# EAGLE design beaglecnc (EAGLE 9.6.2)
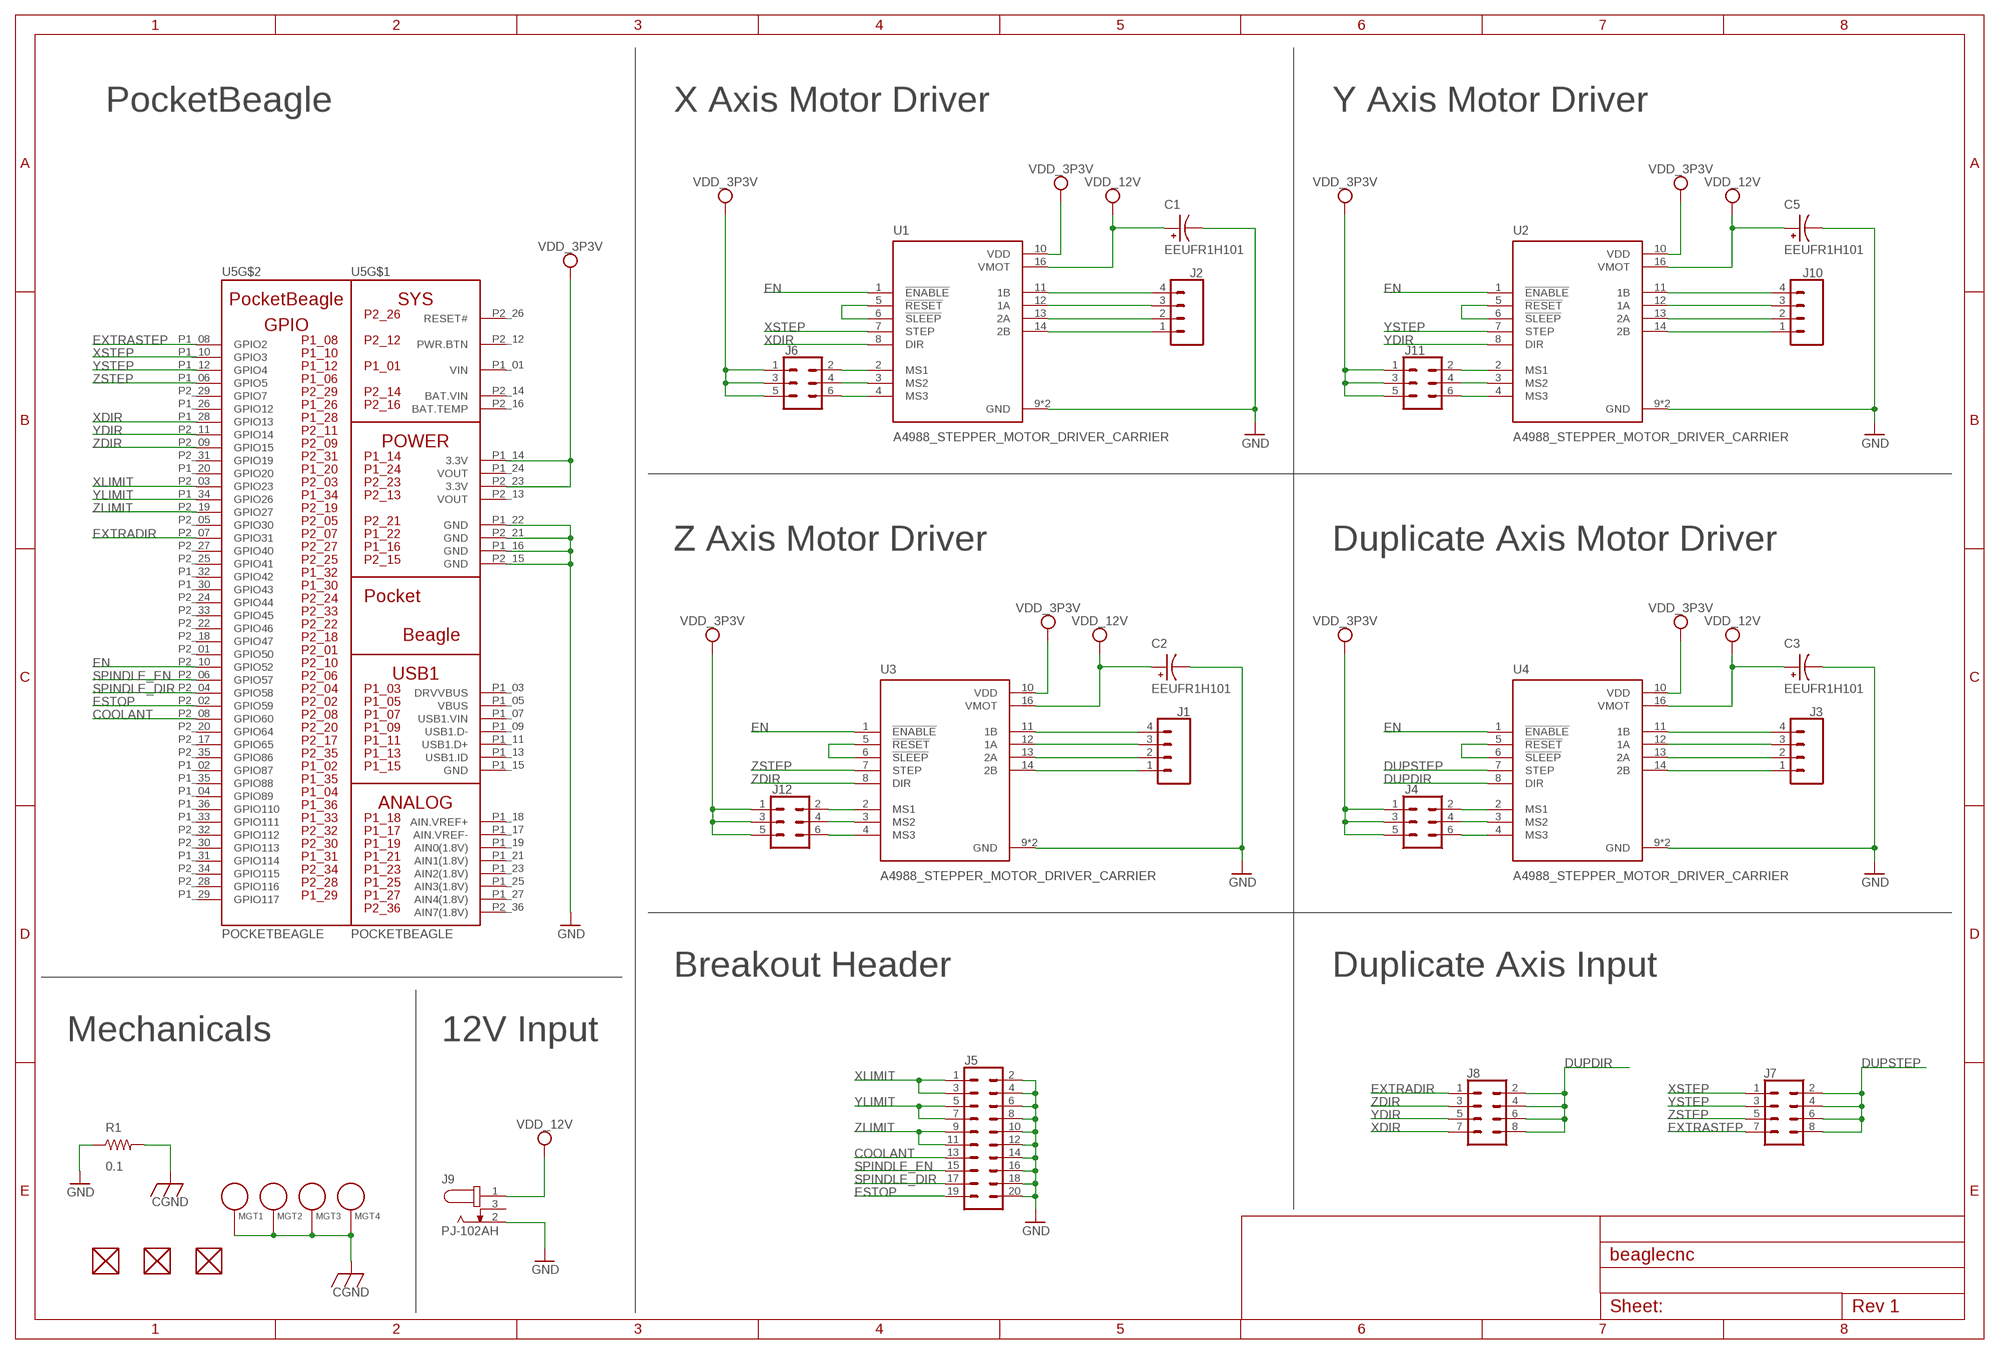
[diagram p0: schematic, sheet 1]

## Parts
C1  EEUFR1H101  [CAPPRD350W60D800H1150]
C2  EEUFR1H101  [CAPPRD350W60D800H1150]
C3  EEUFR1H101  [CAPPRD350W60D800H1150]
C5  EEUFR1H101  [CAPPRD350W60D800H1150]
FUD1  FIDUCIAL  [FIDUCIAL_40MIL]
FUD2  FIDUCIAL  [FIDUCIAL_40MIL]
FUD3  FIDUCIAL  [FIDUCIAL_40MIL]
J1  CONN_04PTH  [1X04]
J2  CONN_04PTH  [1X04]
J3  CONN_04PTH  [1X04]
J4  CONN_03X22X3_SILK_MALE_PTH  [2X3]
J5  CONN_10X2  [2X10]
J6  CONN_03X22X3_SILK_MALE_PTH  [2X3]
J7  CONN_04X2  [2X4]
J8  CONN_04X2  [2X4]
J9  PJ-102AH  [CUI_PJ-102AH]
J10  CONN_04PTH  [1X04]
J11  CONN_03X22X3_SILK_MALE_PTH  [2X3]
J12  CONN_03X22X3_SILK_MALE_PTH  [2X3]
MGT1  MOUNTING_HOLE  [MOUNTING_HOLE]
MGT2  MOUNTING_HOLE  [MOUNTING_HOLE]
MGT3  MOUNTING_HOLE  [MOUNTING_HOLE]
MGT4  MOUNTING_HOLE  [MOUNTING_HOLE]
R1  0.1  R_R0805  [R0805]
U1  A4988_STEPPER_MOTOR_DRIVER_CARRIER  [MODULE_A4988_STEPPER_MOTOR_DRIVER_CARRIER]
U2  A4988_STEPPER_MOTOR_DRIVER_CARRIER  [MODULE_A4988_STEPPER_MOTOR_DRIVER_CARRIER]
U3  A4988_STEPPER_MOTOR_DRIVER_CARRIER  [MODULE_A4988_STEPPER_MOTOR_DRIVER_CARRIER]
U4  A4988_STEPPER_MOTOR_DRIVER_CARRIER  [MODULE_A4988_STEPPER_MOTOR_DRIVER_CARRIER]
U5  POCKETBEAGLE  [POCKETBEAGLE]

## Nets
CGND: MGT1.P$1 MGT2.P$1 MGT3.P$1 MGT4.P$1 R1.2
COOLANT: J5.13 U5.P2_08(GPIO60)
DUPDIR: J8.2 J8.4 J8.6 J8.8 U4.8(DIR)
DUPSTEP: J7.2 J7.4 J7.6 J7.8 U4.7(STEP)
EN: U1.1(!ENABLE) U2.1(!ENABLE) U3.1(!ENABLE) U4.1(!ENABLE) U5.P2_10(GPIO52)
ESTOP: J5.19 U5.P2_02(GPIO59)
EXTRADIR: J8.1 U5.P2_07(GPIO31)
EXTRASTEP: J7.7 U5.P1_08(GPIO2)
GND: C1.N C2.N C3.N C5.N J5.2 J5.4 J5.6 J5.8 J5.10 J5.12 J5.14 J5.16 J5.18 J5.20 J9.2 R1.1 U1.9(GND) U1.15(GND) U2.9(GND) U2.15(GND) U3.9(GND) U3.15(GND) U4.9(GND) U4.15(GND) U5.P1_16(GND) U5.P1_22(GND) U5.P2_15(GND) U5.P2_21(GND)
N$1: J2.4 U1.11(1B)
N$2: J2.3 U1.12(1A)
N$3: J2.2 U1.13(2A)
N$4: J2.1 U1.14(2B)
N$5: U1.5(!RESET) U1.6(!SLEEP)
N$6: J6.2 U1.2(MS1)
N$7: J6.4 U1.3(MS2)
N$8: J6.6 U1.4(MS3)
N$9: J10.4 U2.11(1B)
N$10: J10.3 U2.12(1A)
N$11: J10.2 U2.13(2A)
N$12: J10.1 U2.14(2B)
N$13: U2.5(!RESET) U2.6(!SLEEP)
N$14: J11.2 U2.2(MS1)
N$15: J11.4 U2.3(MS2)
N$16: J11.6 U2.4(MS3)
N$17: J1.4 U3.11(1B)
N$18: J1.3 U3.12(1A)
N$19: J1.2 U3.13(2A)
N$20: J1.1 U3.14(2B)
N$21: U3.5(!RESET) U3.6(!SLEEP)
N$22: J12.2 U3.2(MS1)
N$23: J12.4 U3.3(MS2)
N$24: J12.6 U3.4(MS3)
N$25: J3.4 U4.11(1B)
N$26: J3.3 U4.12(1A)
N$27: J3.2 U4.13(2A)
N$28: J3.1 U4.14(2B)
N$29: U4.5(!RESET) U4.6(!SLEEP)
N$30: J4.2 U4.2(MS1)
N$31: J4.4 U4.3(MS2)
N$32: J4.6 U4.4(MS3)
SPINDLE_DIR: J5.17 U5.P2_04(GPIO58)
SPINDLE_EN: J5.15 U5.P2_06(GPIO57)
VDD_3P3V: J4.1 J4.3 J4.5 J6.1 J6.3 J6.5 J11.1 J11.3 J11.5 J12.1 J12.3 J12.5 U1.10(VDD) U2.10(VDD) U3.10(VDD) U4.10(VDD) U5.P1_14(3.3V) U5.P2_23(3.3V)
VDD_12V: C1.P C2.P C3.P C5.P J9.1 U1.16(VMOT) U2.16(VMOT) U3.16(VMOT) U4.16(VMOT)
XDIR: J8.7 U1.8(DIR) U5.P1_28(GPIO13)
XLIMIT: J5.1 J5.3 U5.P2_03(GPIO23)
XSTEP: J7.1 U1.7(STEP) U5.P1_10(GPIO3)
YDIR: J8.5 U2.8(DIR) U5.P2_11(GPIO14)
YLIMIT: J5.5 J5.7 U5.P1_34(GPIO26)
YSTEP: J7.3 U2.7(STEP) U5.P1_12(GPIO4)
ZDIR: J8.3 U3.8(DIR) U5.P2_09(GPIO15)
ZLIMIT: J5.9 J5.11 U5.P2_19(GPIO27)
ZSTEP: J7.5 U3.7(STEP) U5.P1_06(GPIO5)
Unconnected: FUD1.P$1 FUD2.P$1 FUD3.P$1 J9.3 U5.P1_02(GPIO87) U5.P1_03(DRVVBUS) U5.P1_04(GPIO89) U5.P1_05(VBUS) U5.P1_07(USB1.VIN) U5.P1_09(USB1.D-) U5.P1_11(USB1.D+) U5.P1_13(USB1.ID) U5.P1_15(GND) U5.P1_17(AIN.VREF-) U5.P1_18(AIN.VREF+) U5.P1_19(AIN0(1.8V)) U5.P1_20(GPIO20) U5.P1_21(AIN1(1.8V)) U5.P1_23(AIN2(1.8V)) U5.P1_25(AIN3(1.8V)) U5.P1_26(GPIO12) U5.P1_27(AIN4(1.8V)) U5.P1_29(GPIO117) U5.P1_30(GPIO43) U5.P1_31(GPIO114) U5.P1_32(GPIO42) U5.P1_33(GPIO111) U5.P1_35(GPIO88) U5.P1_36(GPIO110) U5.P2_01(GPIO50) U5.P2_05(GPIO30) U5.P2_12(PWR.BTN) U5.P2_16(BAT.TEMP) U5.P2_17(GPIO65) U5.P2_18(GPIO47) U5.P2_20(GPIO64) U5.P2_22(GPIO46) U5.P2_24(GPIO44) U5.P2_25(GPIO41) U5.P2_26(RESET#) U5.P2_27(GPIO40) U5.P2_28(GPIO116) U5.P2_29(GPIO7) U5.P2_30(GPIO113) U5.P2_31(GPIO19) U5.P2_32(GPIO112) U5.P2_33(GPIO45) U5.P2_34(GPIO115) U5.P2_35(GPIO86) U5.P2_36(AIN7(1.8V))

## Notes on the sheet
- PocketBeagle | X Axis Motor Driver | Y Axis Motor Driver
- Z Axis Motor Driver | Duplicate Axis Motor Driver
- Breakout Header | Duplicate Axis Input
- Mechanicals | 12V Input

## Power pins joined to a net without a drawn wire
BAT.VIN: U5.P2_14(BAT.VIN)
VIN: U5.P1_01(VIN)
VOUT: U5.P1_24(VOUT) U5.P2_13(VOUT)

## Library data of the parts
C1-C3 C5 = beaglecnc:EEUFR1H101: FR-A Check prices <https://pricing.snapeda.com/parts/EEUFR1H101/Panasonic/view-part?ref=eda>; AVAILABILITY: In Stock; DESCRIPTION: 100µF 50V Aluminum Electrolytic Capacitors Radial, Can 6000 Hrs @ 105°C; MF: Panasonic; MP: EEUFR1H101; PACKAGE: RADIAL-2 Panasonic; PRICE: None; PURCHASE-URL: https://pricing.snapeda.com/search/part/EEUFR1H101/?ref=eda
FUD1-FUD3 = beaglecnc:FIDUCIAL
J1-J3 J10 = beaglecnc:CONN_04: Multi connection point. Often used as Generic Header-pin footprint for 0.1 inch spaced/style header connections On any of the 0.1 inch spaced packages, you can populate with these: Break Away Headers - Straight <https://www.sparkfun.com/products/116> (PRT-00116) Break Away Male Headers - Right Angle <https://www.sparkfun.com/products/553> (PRT-00553) Female Headers <https://www.sparkfun.com/products/115> (PRT-00115) Break Away Headers - Machine Pin <https://www.sparkfun.com/products/117> (PRT-00117) Break Away Female Headers - Swiss Machine Pin <https://www.sparkfun.com/products/743> (PRT-00743) For SCREWTERMINALS and SPRING TERMINALS visit here: Screw Terimnals on SparkFun.com <https://www.sparkfun.com/search/results?term=Screw+Terminals> (5mm/3.5mm/2.54mm spacing) This device is also useful as a general connection point to wire up your design to another part of your project. Our various solder wires solder well into these plated through hole pads. Hook-Up Wire - Assortment (Stranded, 22 AWG) <https://www.sparkfun.com/products/11375> (PRT-11375) Hook-Up Wire - Assortment (Solid Core, 22 AWG) <https://www.sparkfun.com/products/11367> (PRT-11367) View the entire wire category on our website here <https://www.sparkfun.com/categories/141> Special notes: Molex polarized connector foot print use with SKU : PRT-08231 with associated crimp pins and housings. 1MM SMD Version SKU: PRT-10208; PROD_ID: CONN-09696
J4 J6 J11 J12 = beaglecnc:CONN_03X2: Multi connection point. Often used as Generic Header-pin footprint for 0.1 inch spaced/style header connections You can populate with any combo of single row headers, but if you'd like an exact match, check these: Header - 2x3 (Male, 0.1") <https://www.sparkfun.com/products/12807> (PRT-12807) Header - 2x3 (Female, 0.1") <https://www.sparkfun.com/products/13010> (PRT-13010) 2x3 Pin Shrouded Header <https://www.sparkfun.com/products/10877> (PRT-10877) On any of the 0.1 inch spaced packages, you can populate with these: Break Away Headers - Straight <https://www.sparkfun.com/products/116> (PRT-00116) Break Away Male Headers - Right Angle <https://www.sparkfun.com/products/553> (PRT-00553) Female Headers <https://www.sparkfun.com/products/115> (PRT-00115) Break Away Headers - Machine Pin <https://www.sparkfun.com/products/117> (PRT-00117) Break Away Female Headers - Swiss Machine Pin <https://www.sparkfun.com/products/743> (PRT-00743) Special note: the shrouded connector mates well with our 3x2 ribbon cables: Ribbon Crimp Connector - 6-pin (2x3, Female) <https://www.sparkfun.com/products/10651> (PRT-10651) Ribbon Cable - 6 wire (15ft) <https://www.sparkfun.com/products/10646> (PRT-10646); PROD_ID: CONN-09701
J5 = beaglecnc:CONN_10X2: Multi connection point. Often used as Generic Header-pin footprint for 0.1 inch spaced/style header connections On any of the 0.1 inch spaced packages, you can populate with these: Break Away Headers - Straight <https://www.sparkfun.com/products/116> (PRT-00116) Break Away Male Headers - Right Angle <https://www.sparkfun.com/products/553> (PRT-00553) Female Headers <https://www.sparkfun.com/products/115> (PRT-00115) Break Away Headers - Machine Pin <https://www.sparkfun.com/products/117> (PRT-00117) Break Away Female Headers - Swiss Machine Pin <https://www.sparkfun.com/products/743> (PRT-00743) Special note about the "SPECIAL" package: This was SPECIALLY designed to be used with our Graphic LCD Backpack. Be sure you want to use this! It is not only staggered on each line of header holes, but IT IS ALSO offset of the center point of the top and bottom lines by 5 mil. This causes the headers to lock into place on the "standard" footprint on the LCD screen. The extra squares on the tdocu layer are there simply to reference other pins (if you were to actually populate a longer header than ten long - this is what we do with the backpacks).
J7 J8 = beaglecnc:CONN_04X2: Multi connection point. Often used as Generic Header-pin footprint for 0.1 inch spaced/style header connections On any of the 0.1 inch spaced packages, you can populate with these: Break Away Headers - Straight <https://www.sparkfun.com/products/116> (PRT-00116) Break Away Male Headers - Right Angle <https://www.sparkfun.com/products/553> (PRT-00553) Female Headers <https://www.sparkfun.com/products/115> (PRT-00115) Break Away Headers - Machine Pin <https://www.sparkfun.com/products/117> (PRT-00117) Break Away Female Headers - Swiss Machine Pin <https://www.sparkfun.com/products/743> (PRT-00743)
J9 = beaglecnc:PJ-102AH: 2.0 mm Center Pin, 5.0 A, Right Angle, Through Hole, Tapered Pins, Dc Power Jack Connector Check prices <https://pricing.snapeda.com/parts/PJ-102AH/CUI%20Devices/view-part?ref=eda>; AVAILABILITY: In Stock; CUI_PURCHASE_URL: https://www.cuidevices.com/product/interconnect/connectors/dc-power-connectors/jacks/pj-102ah?utm_source=snapeda.com&utm_medium=referral&utm_campaign=snapedaBOM; DESCRIPTION: 2.0 x 6.5 mm, 5.0 A, Horizontal, Through Hole, Tapered Pins, Dc Power Jack Connector; MF: CUI Devices; MP: PJ-102AH; PACKAGE: None; PRICE: None; PURCHASE-URL: https://pricing.snapeda.com/search/part/PJ-102AH/?ref=eda
MGT1-MGT4 = beaglecnc:MOUNTING_HOLE: Chassis Mounting Hole w/GND connection ability
R1 = beaglecnc:R_: RESISTOR, American symbol
U1-U4 = beaglecnc:A4988_STEPPER_MOTOR_DRIVER_CARRIER: Stepper motor controler; IC: A4988; 1A; Uin mot: 8÷35V Check prices <https://pricing.snapeda.com/parts/A4988%20STEPPER%20MOTOR%20DRIVER%20CARRIER/Pololu/view-part?ref=eda>; AVAILABILITY: Not in stock; DESCRIPTION: Stepper Motor Driver; MF: Pololu; MP: A4988 STEPPER MOTOR DRIVER CARRIER; PACKAGE: None; PRICE: None
U5 = beaglecnc:POCKETBEAGLE

## Board
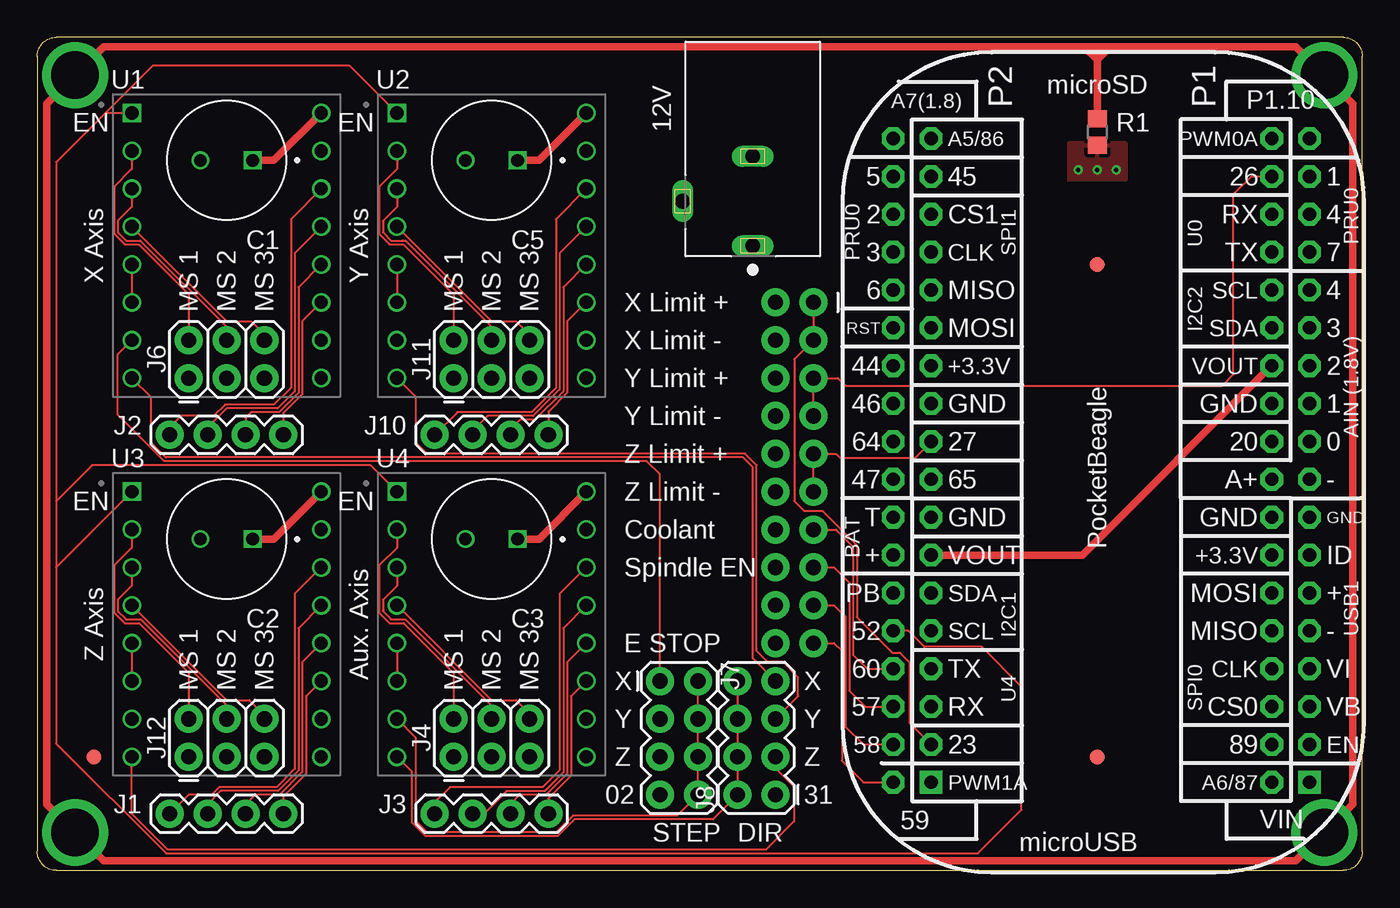
[diagram p1: board, top side]
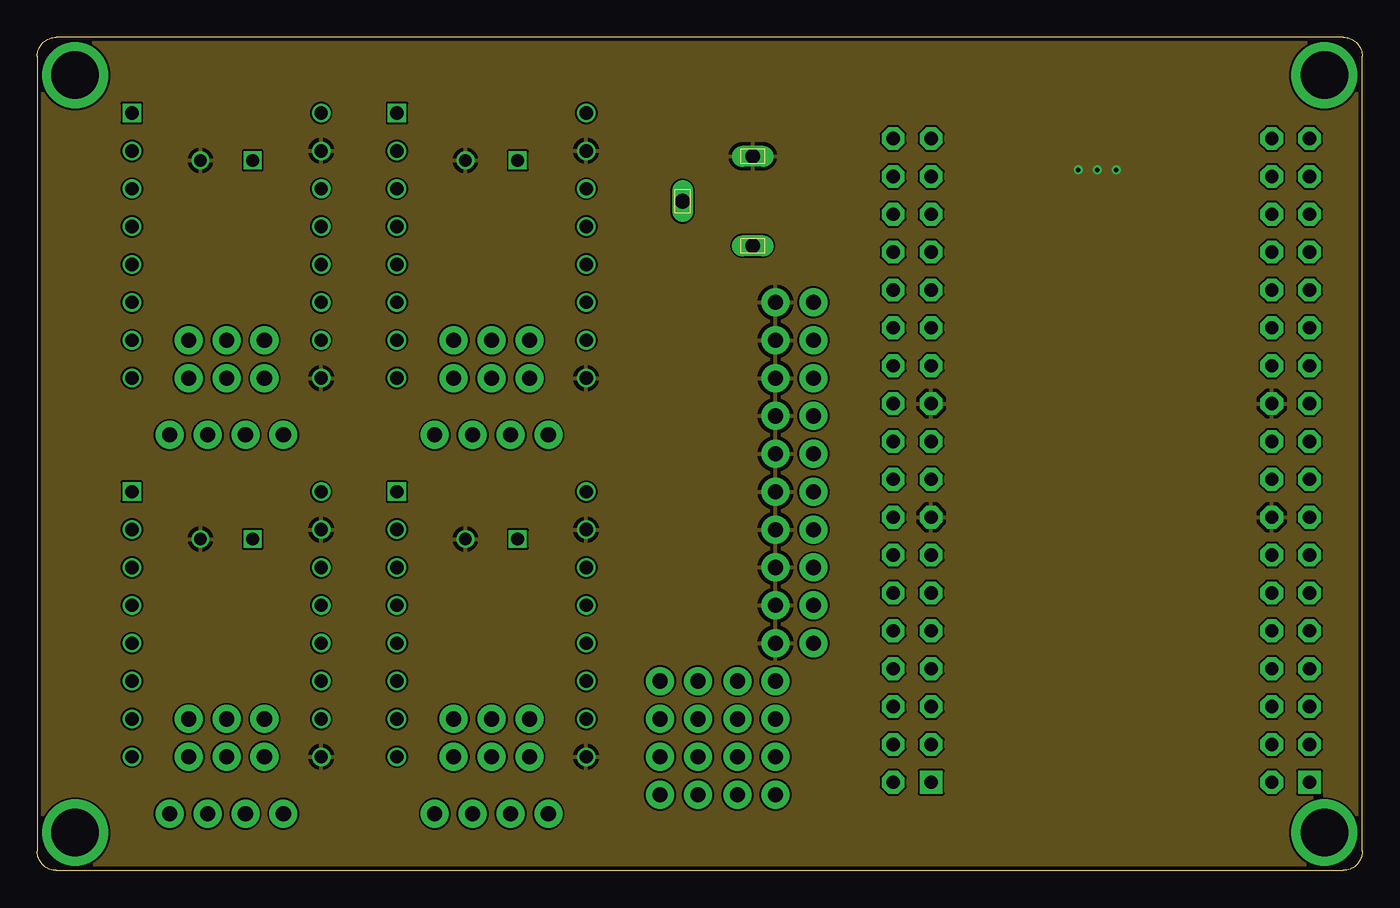
[diagram p2: board, inner layer Route2]
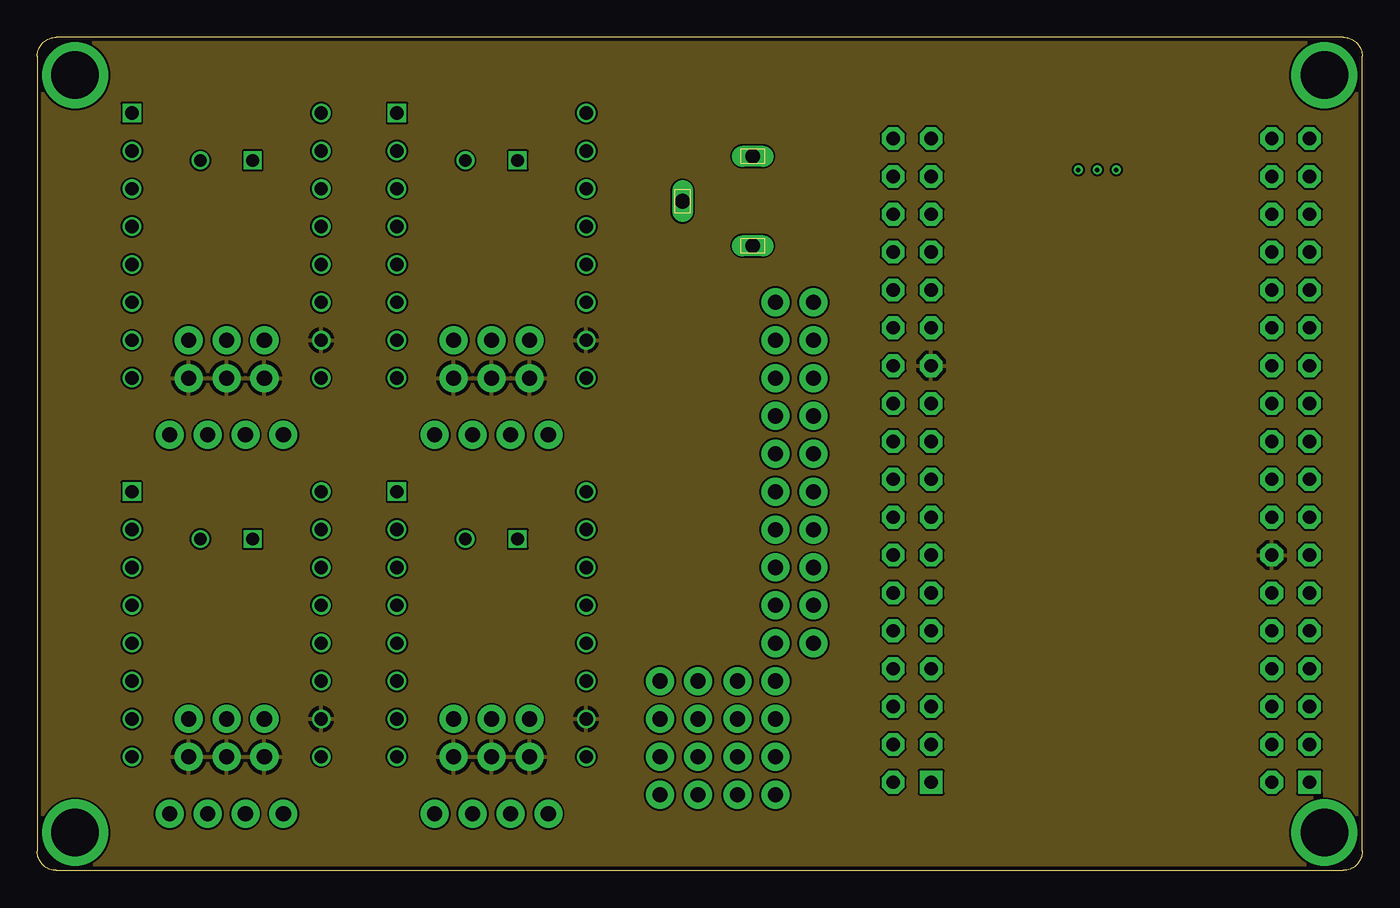
[diagram p3: board, inner layer Route15]
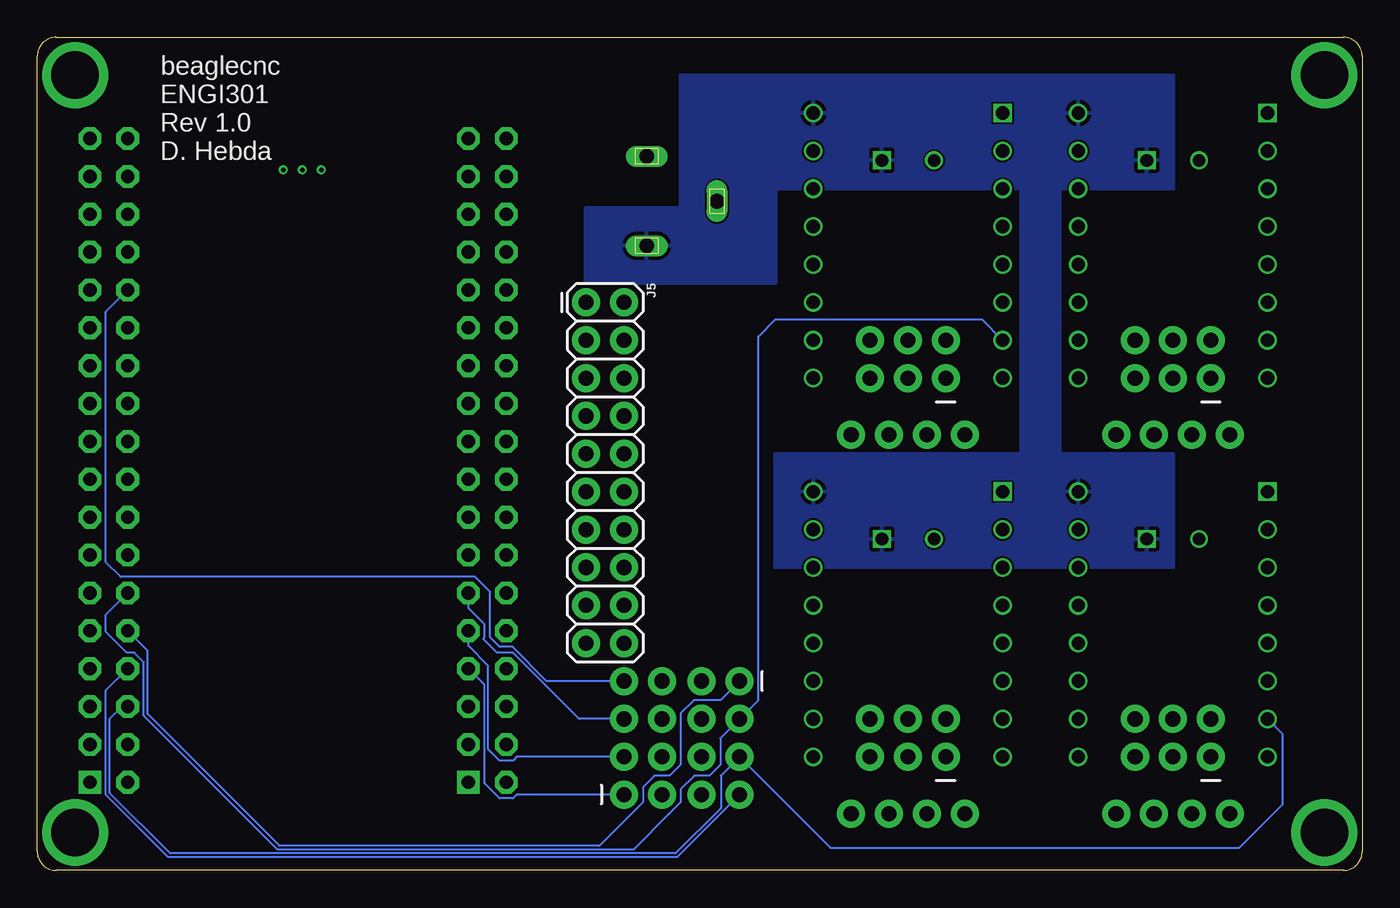
[diagram p4: board, bottom side, seen from below]

Size 88.9 x 55.88 mm. Coordinates in mm from the lower left corner, seen from the top.
Outline: 1.27,0 87.63,0 arc90 88.9,1.27 88.9,54.61 arc90 87.63,55.88 1.27,55.88 arc90 0,54.61 0,1.27 arc90 1.27,0
Copper layers (1*2*15*16): Top 0.035mm / dielectric 0.23mm / Route2 0.035mm / dielectric 0.93mm / Route15 0.035mm / dielectric 0.23mm / Bottom 0.035mm
Design rules "ENGI301_4lyr *": minimum track width 5mil, minimum drill 10mil, track to track 5mil, track to pad 10mil, pad to pad 10mil, via to via 10mil, smd to smd 10mil, copper to edge 10mil, drill to drill 12mil, minimum pad ring 4mil, minimum via ring 4mil, stop-mask expansion 3mil, vias tented up to drill 25mil, thermal gap 10mil

### Footprints (pad centres in the part's own frame; a part is rotated, then mirrored left to right if it is on the bottom)
CAPPRD350W60D800H1150 = drill 0.85 pad 1.2: N 1.75,0 | drill 0.85 pad 1.2 square: P -1.75,0
FIDUCIAL_40MIL = smd 1.016 x 1.016: P$1 0,0
1X04 = drill 1.016 pad 1.88: 1 0,0; 2 2.54,0; 3 5.08,0; 4 7.62,0
2X3 = drill 1.016 pad 1.88: 1 0,0; 2 0,2.54; 3 2.54,0; 4 2.54,2.54; 5 5.08,0; 6 5.08,2.54
2X10 = drill 1.016 pad 1.88: 1 0,0; 2 0,2.54; 3 2.54,0; 4 2.54,2.54; 5 5.08,0; 6 5.08,2.54; 7 7.62,0; 8 7.62,2.54; 9 10.16,0; 10 10.16,2.54; 11 12.7,0; 12 12.7,2.54; 13 15.24,0; 14 15.24,2.54; 15 17.78,0; 16 17.78,2.54; 17 20.32,0; 18 20.32,2.54; 19 22.86,0; 20 22.86,2.54
2X4 = drill 1.016 pad 1.88: 1 -3.81,-1.27; 2 -3.81,1.27; 3 -1.27,-1.27; 4 -1.27,1.27; 5 1.27,-1.27; 6 1.27,1.27; 7 3.81,-1.27; 8 3.81,1.27
CUI_PJ-102AH = drill 1 long: 1 -6.5,0; 2 -0.5,0; 3 -3.5,4.7
MOUNTING_HOLE = drill 3.175 pad 4.445: P$1 0,0
R0805 = smd 1.143 x 1.27: 1 -0.889,0; 2 0.889,0
MODULE_A4988_STEPPER_MOTOR_DRIVER_CARRIER = drill 0.889 square: 1 -6.35,8.89 | drill 0.889: 2 -6.35,6.35; 3 -6.35,3.81; 4 -6.35,1.27; 5 -6.35,-1.27; 6 -6.35,-3.81; 7 -6.35,-6.35; 8 -6.35,-8.89; 9 6.35,-8.89; 10 6.35,-6.35; 11 6.35,-3.81; 12 6.35,-1.27; 13 6.35,1.27; 14 6.35,3.81; 15 6.35,6.35; 16 6.35,8.89
POCKETBEAGLE = drill 0.889 pad 1.524 square: P1_01 5.91,3.53; P2_01 5.91,28.93 | drill 0.889 pad 1.524 octagon: P1_02 5.91,6.07; P1_03 8.45,3.53; P1_04 8.45,6.07; P1_05 10.99,3.53; P1_06 10.99,6.07; P1_07 13.53,3.53; P1_08 13.53,6.07; P1_09 16.07,3.53; P1_10 16.07,6.07; P1_11 18.61,3.53; P1_12 18.61,6.07; P1_13 21.15,3.53; P1_14 21.15,6.07; P1_15 23.69,3.53; P1_16 23.69,6.07; P1_17 26.23,3.53; P1_18 26.23,6.07; P1_19 28.77,3.53; P1_20 28.77,6.07; P1_21 31.31,3.53; P1_22 31.31,6.07; P1_23 33.85,3.53; P1_24 33.85,6.07; P1_25 36.39,3.53; P1_26 36.39,6.07; P1_27 38.93,3.53; P1_28 38.93,6.07; P1_29 41.47,3.53; P1_30 41.47,6.07; P1_31 44.01,3.53; P1_32 44.01,6.07; P1_33 46.55,3.53; P1_34 46.55,6.07; P1_35 49.09,3.53; P1_36 49.09,6.07; P2_02 5.91,31.47; P2_03 8.45,28.93; P2_04 8.45,31.47; P2_05 10.99,28.93; P2_06 10.99,31.47; P2_07 13.53,28.93; P2_08 13.53,31.47; P2_09 16.07,28.93; P2_10 16.07,31.47; P2_11 18.61,28.93; P2_12 18.61,31.47; P2_13 21.15,28.93; P2_14 21.15,31.47; P2_15 23.69,28.93; P2_16 23.69,31.47; P2_17 26.23,28.93; P2_18 26.23,31.47; P2_19 28.77,28.93; P2_20 28.77,31.47; P2_21 31.31,28.93; P2_22 31.31,31.47; P2_23 33.85,28.93; P2_24 33.85,31.47; P2_25 36.39,28.93; P2_26 36.39,31.47; P2_27 38.93,28.93; P2_28 38.93,31.47; P2_29 41.47,28.93; P2_30 41.47,31.47; P2_31 44.01,28.93; P2_32 44.01,31.47; P2_33 46.55,28.93; P2_34 46.55,31.47; P2_35 49.09,28.93; P2_36 49.09,31.47

### Placement (x,y rotation side)
C1  12.7,47.62 180 top
C2  12.7,22.23 180 top
C3  30.48,22.23 180 top
C5  30.48,47.62 180 top
FUD1  71.12,40.64 0 top
FUD2  71.12,7.62 0 top
FUD3  3.81,7.62 0 top
J1  8.89,3.81 0 top
J2  8.89,29.21 0 top
J3  26.67,3.81 0 top
J4  27.94,7.62 0 top
J5  52.07,38.1 270 bottom
J6  10.16,33.02 0 top
J7  43.05,8.89 270 top
J8  48.26,8.89 90 top
J9  48.01,48.39 90 top
J10  26.67,29.21 0 top
J11  27.94,33.02 0 top
J12  10.16,7.62 0 top
MGT1  2.54,53.34 0 top
MGT2  2.54,2.54 0 top
MGT3  86.36,2.54 0 top
MGT4  86.36,53.34 0 top
R1  71.12,49.53 90 top
U1  12.7,41.91 0 top
U2  30.48,41.91 0 top
U3  12.7,16.51 0 top
U4  30.48,16.51 0 top
U5  88.9,0 90 top

### Tracks (layer width: path | path; a pad name or v marks a point on that pad's centre or on a via)
CGND
  Top 0.508: 70.23,55.24 71.12,55.24 | 71.12,55.24 72.01,55.24 | 72.01,55.24 84.45,55.24 MGT4.P$1 88.27,51.44 88.27,4.45 MGT3.P$1 84.45,0.64 4.45,0.64 MGT2.P$1 0.64,4.45 0.64,51.44 MGT1.P$1 4.45,55.24 70.1,55.24 70.23,55.24 | R1.2 71.12,54.36 | 71.12,54.36 71.12,55.24 | 71.12,54.36 72.01,55.24 | 71.12,54.36 70.23,55.24
COOLANT
  Top 0.127: J5.13 53.59,22.86 54.74,21.72 54.74,14.48 55.69,13.53 U5.P2_08
DUPDIR
  Top 0.127: J8.8 J8.6 J8.4 J8.2 45.34,3.43 36.05,3.43 34.92,2.3 26.04,2.3 25.16,3.18 25.16,4.18 25.15,4.19 25.15,6.6 U4.8
DUPSTEP
  Top 0.127: J7.2 J7.4 J7.6 J7.8 42.93,3.68 35.94,3.68 34.81,2.55 26.15,2.55 25.41,3.29 25.41,8.88 U4.7
EN
  Top 0.127: U2.1 20.95,53.98 7.75,53.98 4.57,50.8 | U5.P2_10 58.44,16.07 59.52,14.99 63.37,14.99 66.04,12.32 66.04,4.06 63.12,1.14 8.64,1.14 1.27,8.51 1.27,20.32 | 1.27,24.77 1.27,47.5 4.57,50.8 | U1.1 4.57,50.8 | U3.1 1.27,20.32 | 1.27,24.77 1.27,20.32 | U4.1 22.35,27.18 3.68,27.18 1.27,24.77
ESTOP
  Top 0.127: J5.19 53.47,15.24 53.98,14.73 53.98,7.37 55.43,5.91 U5.P2_02
EXTRADIR
  Bottom 0.127: J8.1 56.73,5.08 56.98,4.83 57.88,4.83 58.89,5.84 58.89,12.45 U5.P2_07
EXTRASTEP
  Bottom 0.127: J7.7 45.97,0.89 80.1,0.89 84.29,5.08 84.29,12.07 U5.P1_08
GND  (via drill 0.3 pad 0.61)
  other vias: 69.85,46.99 71.12,46.99 72.39,46.99
  pour Route2: -1.27,57.15 90.17,57.15 90.17,-1.27 -1.27,-1.27
  pour Top: 69.22,48.77 69.22,46.35 73.03,46.35 73.03,48.77
N$1
  Top 0.127: U1.11 17.78,36.83 17.78,31.92 16.51,30.65 J2.4
N$2
  Top 0.127: U1.12 17.53,39.12 17.53,32.03 16.23,30.73 14.35,30.73 13.97,30.35 J2.3
N$3
  Top 0.127: U1.13 17.27,41.4 17.27,32.13 16.13,30.99 12.7,30.99 11.43,29.72 J2.2
N$4
  Top 0.127: U1.14 17.02,43.69 17.02,32.38 15.88,31.24 12.6,31.24 11.83,30.48 9.65,30.48 8.89,29.72 J2.1
N$5
  Top 0.127: U1.5 U1.6
N$6
  Top 0.127: U1.2 6.35,47.05 5.16,45.85 5.16,42.69 5.86,41.99 6.8,41.99 10.16,38.63 J6.2
N$7
  Top 0.127: U1.3 6.35,44.51 5.41,43.57 5.41,42.79 5.96,42.24 6.91,42.24 12.7,36.45 J6.4
N$8
  Top 0.127: U1.4 12.7,36.83 14.35,36.83 15.24,35.94 J6.6
N$9
  Top 0.127: U2.11 35.56,36.83 35.56,32.05 34.29,30.78 J10.4
N$10
  Top 0.127: U2.12 35.31,39.12 35.31,32.15 33.38,30.23 32.38,30.23 31.75,29.59 J10.3
N$11
  Top 0.127: U2.13 35.05,41.4 35.05,32.26 33.27,30.48 30.23,30.48 29.21,29.46 J10.2
N$12
  Top 0.127: U2.14 34.8,43.69 34.8,32.36 33.17,30.73 28.19,30.73 J10.1
N$13
  Top 0.127: U2.5 U2.6
N$14
  Top 0.127: U2.2 24.13,47.05 22.94,45.85 22.94,42.69 23.64,41.99 24.38,41.99 24.43,41.99 24.56,41.99 27.94,38.61 J11.2
N$15
  Top 0.127: U2.3 24.13,44.51 23.19,43.57 23.19,42.79 23.74,42.24 24.51,42.24 24.56,42.24 24.71,42.24 30.48,36.47 30.48,36.32 30.48,35.94 J11.4
N$16
  Top 0.127: U2.4 30.48,36.83 32.13,36.83 33.02,35.94 J11.6
N$17
  Top 0.127: U3.11 18.03,11.68 18.03,6.48 16.51,4.95 J1.4
N$18
  Top 0.127: U3.12 17.78,13.97 17.78,6.6 16.26,5.08 14.61,5.08 13.97,4.45 J1.3
N$19
  Top 0.127: U3.13 17.53,16.26 17.53,6.71 16.15,5.33 12.32,5.33 11.43,4.45 J1.2
N$20
  Top 0.127: U3.14 17.27,18.54 17.27,6.81 16.05,5.59 12.21,5.59 11.69,5.07 10.15,5.07 J1.1
N$21
  Top 0.127: U3.5 U3.6
N$22
  Top 0.127: U3.2 6.35,21.65 5.16,20.45 5.16,17.29 5.86,16.59 6.83,16.59 10.16,13.25 J12.2
N$23
  Top 0.127: U3.3 6.35,19.11 5.41,18.17 5.41,17.39 5.96,16.84 6.93,16.84 12.7,11.07 J12.4
N$24
  Top 0.127: U3.4 12.7,11.43 14.22,11.43 15.24,10.41 J12.6
N$25
  Top 0.127: U4.11 35.81,11.68 35.81,6.35 34.29,4.83 J3.4
N$26
  Top 0.127: U4.12 35.56,13.97 35.56,6.48 34.15,5.07 32.37,5.07 31.75,4.45 J3.3
N$27
  Top 0.127: U4.13 35.31,16.26 35.31,6.59 34.04,5.32 31.48,5.32 29.97,3.81 J3.2
N$28
  Top 0.127: U4.14 35.05,18.54 35.05,6.73 33.91,5.59 27.69,5.59 26.67,4.57 J3.1
N$29
  Top 0.127: U4.5 U4.6
N$30
  Top 0.127: U4.2 24.13,21.65 22.94,20.45 22.94,17.29 23.64,16.59 24.58,16.59 27.94,13.23 J4.2
N$31
  Top 0.127: U4.3 24.13,19.11 23.19,18.17 23.19,17.39 23.74,16.84 24.69,16.84 30.48,11.05 J4.4
N$32
  Top 0.127: U4.4 30.48,11.43 32.13,11.43 33.02,10.54 J4.6
SPINDLE_DIR
  Top 0.127: J5.17 53.47,17.78 54.23,17.02 54.23,9.65 55.43,8.45 U5.P2_04
SPINDLE_EN
  Top 0.127: J5.15 53.47,20.32 54.48,19.3 54.48,12.06 55.56,10.99 U5.P2_06
VDD_3P3V
  pour Route15: -2.54,58.42 91.44,58.42 91.44,-2.54 -2.54,-2.54
VDD_12V
  Top 0.508: U2.16 33.66,47.62 C5.P | U4.16 33.66,22.23 C3.P | U3.16 15.88,22.23 C2.P | U1.16 15.88,47.62 C1.P
  pour Bottom: 12.7,53.34 12.7,45.72 20.32,45.72 20.32,27.94 12.7,27.94 12.7,20.32 39.37,20.32 39.37,27.94 22.86,27.94 22.86,45.72 39.37,45.72 39.37,39.37 52.07,39.37 52.07,44.45 45.72,44.45 45.72,53.34
VOUT
  Top 0.254: 82.81,33.85 U5.P1_24
  Top 0.508: U5.P2_13 70.11,21.15 82.81,33.85
XDIR
  Top 0.127: J8.7 48.01,14.22 48.01,27.05 47.36,27.7 8.62,27.7 7.63,28.69 7.63,31.74 U1.8
  Bottom 0.127: J8.7 54.71,12.7 57.01,14.99 57.88,14.99 58.51,15.62 58.51,18.68 59.52,19.69 83.28,19.69 83.28,19.68 83.31,19.68 84.29,20.66 84.29,37.47 U5.P1_28
XLIMIT
  Top 0.127: J5.1 J5.3 50.8,34.29 50.8,24.77 51.45,24.12 52.7,24.12 54.99,21.82 54.99,16.98 57.36,14.61 57.88,14.61 58.51,13.98 58.51,9.91 U5.P2_03
XSTEP
  Top 0.127: J7.1 41.78,26.56 40.89,27.45 8.52,27.45 5.41,30.55 5.41,34.62 U1.7
  Bottom 0.127: 49.01,3.82 48.27,4.56 48.27,5.58 47.48,6.36 46.47,6.36 45.73,7.1 45.73,10.53 44.84,11.42 43.07,11.42 J7.1 | 49.01,3.82 | 49.01,3.82 51.18,1.65 72.64,1.65 81.5,10.5 81.5,14.74 U5.P1_10
YDIR
  Top 0.127: J8.5 51.05,11.68 51.05,12.95 50.02,13.98 49.01,13.98 48.27,14.72 48.27,14.85 48.26,14.86 48.26,27.18 47.48,27.95 26.15,27.95 25.41,28.69 25.41,31.74 U2.8
  Bottom 0.127: J8.5 52.53,10.16 56.98,14.61 58.04,14.61 58.97,15.54 58.89,15.62 58.89,16.52 59.97,17.6 U5.P2_11
YLIMIT
  Top 0.127: J5.7 J5.5 53.72,33.02 54.23,32.51 79.5,32.51 80.26,33.27 80.26,45.34 81.47,46.55 U5.P1_34
YSTEP
  Bottom 0.127: J7.3 43.07,8.88 43.07,7.1 43.8,6.36 44.82,6.36 45.73,5.45 45.73,4.56 46.47,3.82 | 46.47,3.82 | 46.47,3.82 48.9,1.4 72.77,1.4 81.75,10.38 81.75,13.98 82.38,14.61 82.9,14.61 84.29,16 84.29,17.15 U5.P1_12 | J7.3 | J7.3 40.53,11.42 40.53,35.8 39.37,36.96 25.53,36.96 U2.7
ZDIR
  Top 0.127: J8.3 49.53,6.86 50.79,5.6 50.79,3.29 48.9,1.4 8.76,1.4 6.35,3.81 U3.8
  Bottom 0.127: J8.3 56.73,7.62 56.98,7.37 57.88,7.37 58.64,8.13 58.64,13.72 59.97,15.06 U5.P2_09
ZLIMIT
  Top 0.127: J5.11 J5.9 53.59,27.94 53.85,27.69 58.93,27.69 59.97,28.73 U5.P2_19
ZSTEP
  Bottom 0.127: J7.5 | J7.5 43.04,6.36 43.04,4.18 46.08,1.14 80,1.14 84.04,5.18 84.04,10.16 83.21,10.99 U5.P1_06 | J7.5 35.69,1.52 8.26,1.52 5.33,4.45 5.33,9.14 U3.7

### Text on the board
tNames: EN | EN | 12V | X Axis | Y Axis | MS 1 | MS 2 | MS 3 | MS 1 | MS 2 | MS 3 | X Limit + | X Limit - | Y Limit + | Y Limit - | Z Limit + | EN | EN | Z Limit - | Coolant | Spindle EN | Z Axis | Aux. Axis | E STOP | MS 1 | MS 2 | MS 3 | MS 1 | MS 2 | MS 3 | X | X | Y | Y | Z | Z | 02 | 31 | STEP | DIR
bNames: beaglecnc | ENGI301 | Rev 1.0 | D. Hebda